# Altium project PS_project1.PrjPcb
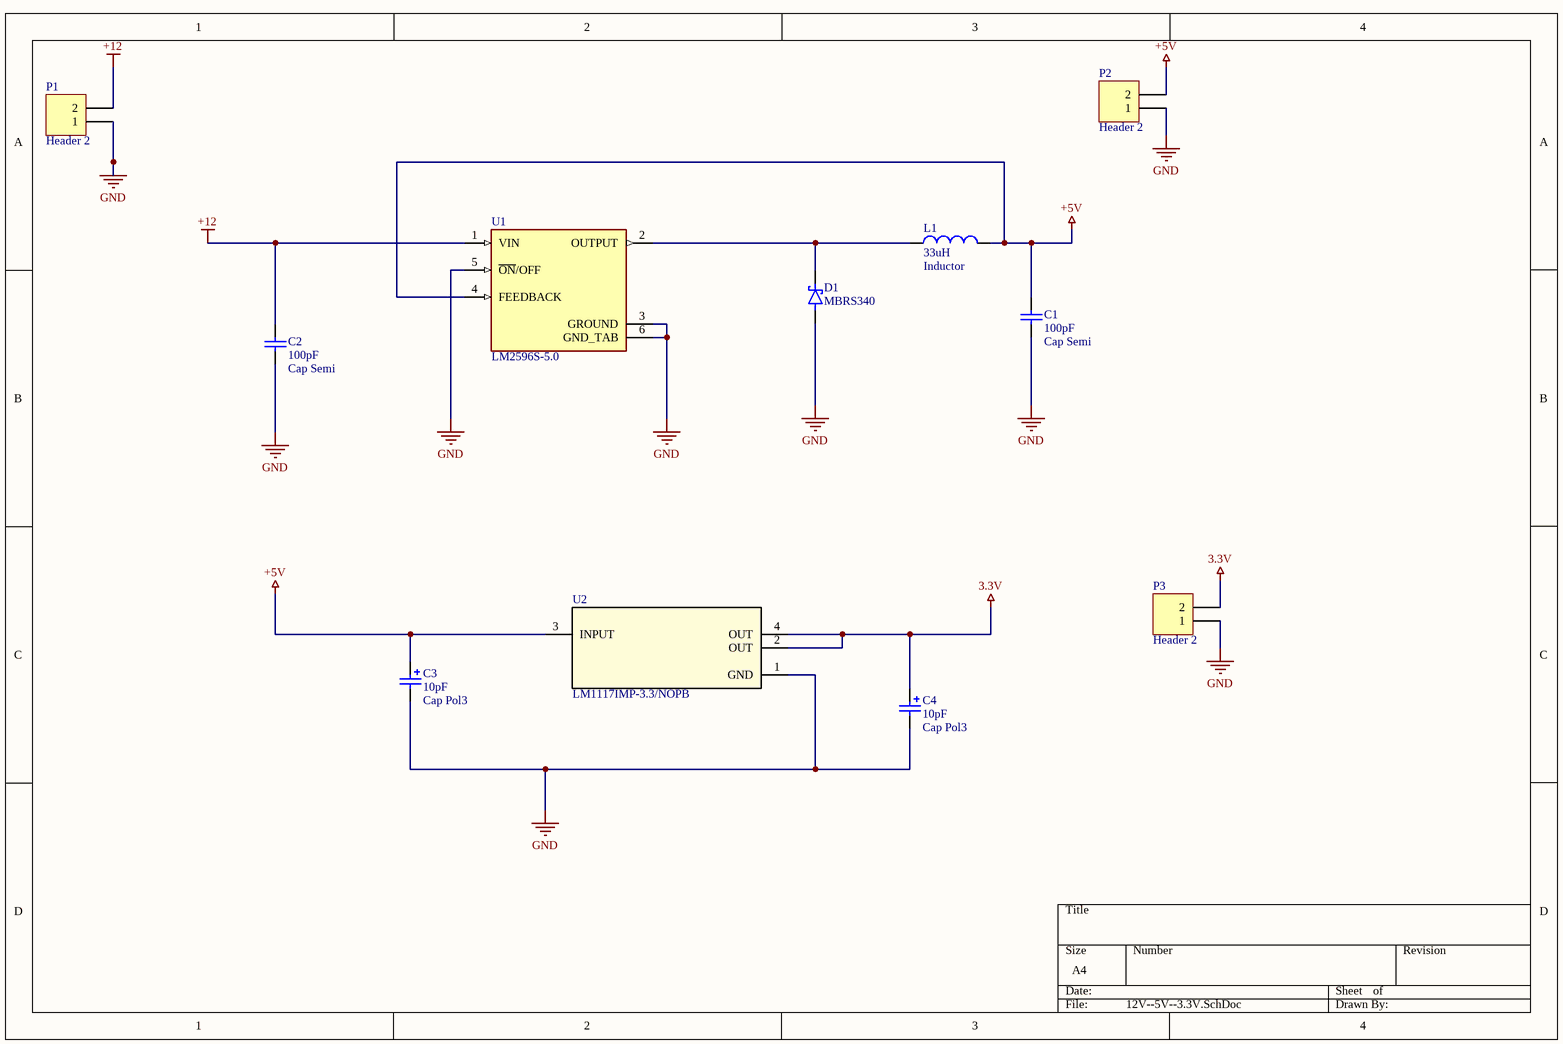
[diagram p0: 12V--5V--3.3V.SchDoc]
1 sheet, 11 parts. Net scope: global (net labels, ports and power ports of the same name join across sheets).
Board file: PS_PCB.PcbDoc

## Sheet 12V--5V--3.3V.SchDoc
size A4; SheetNumber: 1; SheetTotal: 1; SPICEModelCacheYFCSUOFA: <root> / <DocumentId>YFCSUOFA</DocumentId> / </root>

### Parts
C1  Cap Semi  value 100pF  [C1206]
C2  Cap Semi  value 100pF  [C1206]
C3  Cap Pol3  value 10pF  [C0805]
C4  Cap Pol3  value 10pF  [C0805]
D1  MBRS340  [DIOM7959X261N]
L1  Inductor  value 33uH  [0402-A]
P1  Header 2  [HDR1X2]
P2  Header 2  [HDR1X2]
P3  Header 2  [HDR1X2]
U1  LM2596S-5.0  [TO170P1524X483-6N]
U2  LM1117IMP-3.3/NOPB  [DCY0004A_N]

### Nets
3.3V: C4.1 P3.2 U2.2(OUT) U2.4(OUT)
+5V: C1.2 C3.1 L1.2 P2.2 U1.4(FEEDBACK) U2.3(INPUT)
+12: C2.2 P1.2 U1.1(VIN)
GND: C1.1 C2.1 C3.2 C4.2 D1.A P1.1 P2.1 P3.1 U1.3(GROUND) U1.5(~{ON}/OFF) U1.6(GND_TAB) U2.1(GND)
NetD1_C: D1.C(K) L1.1 U1.2(OUTPUT)

### Library data of the parts
C1 C2 = Cap Semi: Capacitor (Semiconductor SIM Model); Published: 8-Jun-2000; LatestRevisionDate: 29-May-2009; LatestRevisionNote: IPC-7351 Footprint Added.; PackageReference: C1206; Publisher: Altium Limited; PackageDescription: Chip Capacitor
C3 C4 = Cap Pol3: Polarized Capacitor (Surface Mount); Published: 8-Jun-2000; LatestRevisionDate: 29-May-2009; LatestRevisionNote: IPC-7351 Footprint Added.; PackageReference: C0805; Publisher: Altium Limited; PackageDescription: Chip Capacitor
D1 = MBRS340: Diode 40 V 4A Surface Mount DO-214AB (SMC); MF: onsemi; SnapEDA_Link: https://www.snapeda.com/parts/MBRS340/Onsemi/view-part/?ref=snap; Package: None; Value: *; MP: MBRS340; Check_prices: https://www.snapeda.com/parts/MBRS340/Onsemi/view-part/?ref=eda
L1 = Inductor: Code_IEC: 1005; Published: 8-Jun-2000; LatestRevisionDate: 29-May-2009; LatestRevisionNote: IPC-7351 Footprint Added.; PackageReference: 0402-A; Publisher: Altium Limited; PackageDescription: Chip Inductor; Code_JEITA: 0402
P1-P3 = Header 2: Header, 2-Pin; LatestRevisionDate: 17-Jul-2002; LatestRevisionNote: Re-released for DXP Platform.; Publisher: Altium Limited
U1 = LM2596S-5.0: SIMPLE SWITCHERÂ® 4.5V to 40V, 3A Low Component Count Step-Down Regulator; MF: Texas Instruments; MP: LM2596S-5.0/NOPB; SnapEDA_Link: https://www.snapeda.com/parts/LM2596S-5.0/NOPB/Texas+Instruments/view-part/?ref=snap; Package: TO-263-5 Texas Instruments; Value: *; Check_prices: https://www.snapeda.com/parts/LM2596S-5.0/NOPB/Texas+Instruments/view-part/?ref=eda
U2 = LM1117IMP-3.3NOPB: 800-mA 15-V linear voltage regulator 4-SOT-223 -40 to 125; Manufacturer_Name: Texas Instruments; TYPE: TYPE; RefDes: RefDes; Copyright: Copyright (C) 2025 Ultra Librarian. All rights reserved.; Manufacturer_Part_Number: LM1117IMP-3.3/NOPB